# Altium schematic sheet 0214_PD CONTROLLER.SchDoc
size A3
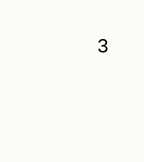
[diagram p0: 0214_PD CONTROLLER.SchDoc, top right]
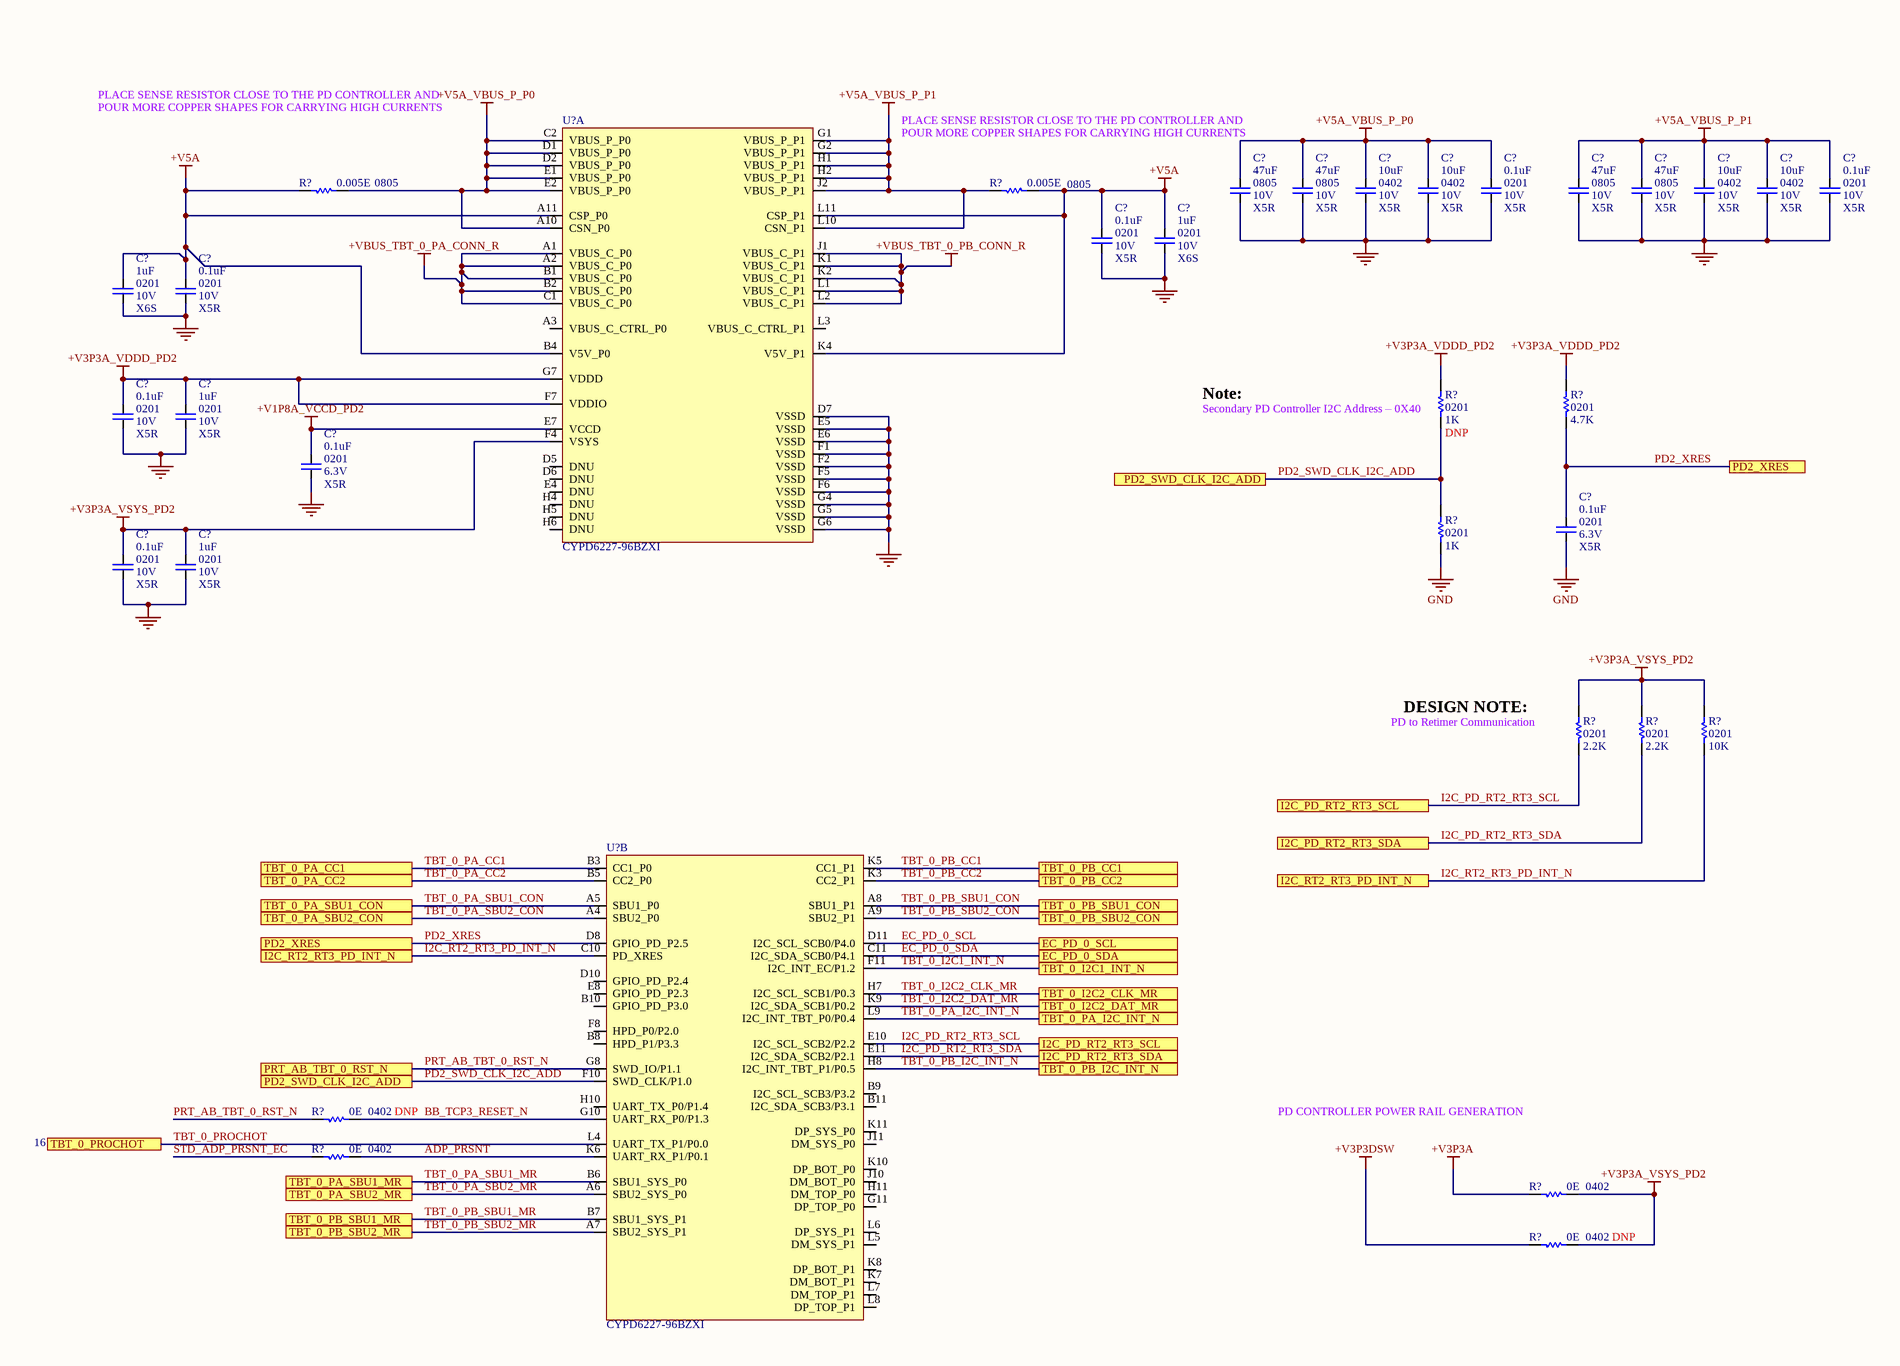
[diagram p1: 0214_PD CONTROLLER.SchDoc, bottom left]

## Parts
(Parts that share a designator on the sheet are numbered #1, #2 ... from top to bottom, then left to right.)
C?#1  value 47uF  Case/Package: 0805  Voltage: 10V  Dielectric: X5R  [CAPC0805]
C?#2  value 47uF  Case/Package: 0805  Voltage: 10V  Dielectric: X5R  [CAPC0805]
C?#3  value 10uF  Case/Package: 0402  Voltage: 10V  Dielectric: X5R  [CAPC0805]
C?#4  value 10uF  Case/Package: 0402  Voltage: 10V  Dielectric: X5R  [CAPC0805]
C?#5  value 0.1uF  Case/Package: 0201  Voltage: 10V  Dielectric: X5R  [CAPC0201]
C?#6  value 47uF  Case/Package: 0805  Voltage: 10V  Dielectric: X5R  [CAPC0805]
C?#7  value 47uF  Case/Package: 0805  Voltage: 10V  Dielectric: X5R  [CAPC0805]
C?#8  value 10uF  Case/Package: 0402  Voltage: 10V  Dielectric: X5R  [CAPC0805]
C?#9  value 10uF  Case/Package: 0402  Voltage: 10V  Dielectric: X5R  [CAPC0805]
C?#10  value 0.1uF  Case/Package: 0201  Voltage: 10V  Dielectric: X5R  [CAPC0201]
C?#11  value 0.1uF  Case/Package: 0201  Voltage: 10V  Dielectric: X5R  [CAPC0201]
C?#12  value 1uF  Case/Package: 0201  Voltage: 10V  Dielectric: X6S  [CAPC0201]
C?#13  value 1uF  Case/Package: 0201  Voltage: 10V  Dielectric: X6S  [CAPC0201]
C?#14  value 0.1uF  Case/Package: 0201  Voltage: 10V  Dielectric: X5R  [CAPC0201]
C?#15  value 0.1uF  Case/Package: 0201  Voltage: 10V  Dielectric: X5R  [CAPC0201]
C?#16  value 1uF  Case/Package: 0201  Voltage: 10V  Dielectric: X5R  [CAPC0201]
C?#17  value 0.1uF  Case/Package: 0201  Voltage: 6.3V  Dielectric: X5R  [CAPC0201]
C?#18  value 0.1uF  Case/Package: 0201  Voltage: 6.3V  Dielectric: X5R  [CAPC0201]
C?#19  value 0.1uF  Case/Package: 0201  Voltage: 10V  Dielectric: X5R  [CAPC0201]
C?#20  value 1uF  Case/Package: 0201  Voltage: 10V  Dielectric: X5R  [CAPC0201]
R?#1  value 0.005E  Case/Package: 0805  [RESC0805]  (hidden comment: Res)
R?#2  value 0.005E  Case/Package: 0805  [RESC0805]  (hidden comment: Res)
R?#3  value 1K  Case/Package: 0201  [RESC0402]  (hidden comment: Res)
R?#4  value 4.7K  Case/Package: 0201  [RESC0402]  (hidden comment: Res)
R?#5  value 1K  Case/Package: 0201  [RESC0402]  (hidden comment: Res)
R?#6  value 2.2K  Case/Package: 0201  [RESC0402]  (hidden comment: Res)
R?#7  value 2.2K  Case/Package: 0201  [RESC0402]  (hidden comment: Res)
R?#8  value 10K  Case/Package: 0201  [RESC0402]  (hidden comment: Res)
R?#9  value 0E  Case/Package: 0402  [RESC0402]  (hidden comment: Res)
R?#10  value 0E  Case/Package: 0402  [RESC0402]  (hidden comment: Res)
R?#11  value 0E  Case/Package: 0402  [RESC0402]  (hidden comment: Res)
R?#12  value 0E  Case/Package: 0402  [RESC0402]  (hidden comment: Res)
U?#1  CYPD6227-96BZXI  (part A of 2)
U?#2  CYPD6227-96BZXI  (part B of 2)

## Ports
EC_PD_0_SCL, EC_PD_0_SDA, I2C_PD_RT2_RT3_SCL, I2C_PD_RT2_RT3_SDA, I2C_RT2_RT3_PD_INT_N, PD2_SWD_CLK_I2C_ADD, PD2_XRES, PRT_AB_TBT_0_RST_N, TBT_0_I2C1_INT_N, TBT_0_I2C2_CLK_MR, TBT_0_I2C2_DAT_MR, TBT_0_PA_CC1, TBT_0_PA_CC2, TBT_0_PA_I2C_INT_N, TBT_0_PA_SBU1_CON, TBT_0_PA_SBU1_MR, TBT_0_PA_SBU2_CON, TBT_0_PA_SBU2_MR, TBT_0_PB_CC1, TBT_0_PB_CC2, TBT_0_PB_I2C_INT_N, TBT_0_PB_SBU1_CON, TBT_0_PB_SBU1_MR, TBT_0_PB_SBU2_CON, TBT_0_PB_SBU2_MR, TBT_0_PROCHOT

## Nets
+V1P8A_VCCD_PD2: C?#17.2 U?#1.E7(VCCD)
+V3P3A: R?#11.1
+V3P3A_VDDD_PD2: C?#15.2 C?#16.2 R?#3.2 R?#4.2 U?#1.F7(VDDIO) U?#1.G7(VDDD)
+V3P3A_VSYS_PD2: C?#19.2 C?#20.2 R?#6.2 R?#7.2 R?#8.2 R?#11.2 R?#12.2 U?#1.F4(VSYS)
+V3P3DSW: R?#12.1
+V5A: C?#11.2 C?#12.2 C?#13.2 C?#14.2 R?#1.1 R?#2.2 U?#1.A11(CSP_P0) U?#1.B4(V5V_P0) U?#1.K4(V5V_P1) U?#1.L11(CSP_P1)
+V5A_VBUS_P_P0: C?#1.2 C?#2.2 C?#3.2 C?#4.2 C?#5.2 R?#1.2 U?#1.A10(CSN_P0) U?#1.C2(VBUS_P_P0) U?#1.D1(VBUS_P_P0) U?#1.D2(VBUS_P_P0) U?#1.E1(VBUS_P_P0) U?#1.E2(VBUS_P_P0)
+V5A_VBUS_P_P1: C?#6.2 C?#7.2 C?#8.2 C?#9.2 C?#10.2 R?#2.1 U?#1.G1(VBUS_P_P1) U?#1.G2(VBUS_P_P1) U?#1.H1(VBUS_P_P1) U?#1.H2(VBUS_P_P1) U?#1.J2(VBUS_P_P1) U?#1.L10(CSN_P1)
+VBUS_TBT_0_PA_CONN_R: U?#1.A1(VBUS_C_P0) U?#1.A2(VBUS_C_P0) U?#1.B1(VBUS_C_P0) U?#1.B2(VBUS_C_P0) U?#1.C1(VBUS_C_P0)
+VBUS_TBT_0_PB_CONN_R: U?#1.J1(VBUS_C_P1) U?#1.K1(VBUS_C_P1) U?#1.K2(VBUS_C_P1) U?#1.L1(VBUS_C_P1) U?#1.L2(VBUS_C_P1)
GND: C?#1.1 C?#2.1 C?#3.1 C?#4.1 C?#5.1 C?#6.1 C?#7.1 C?#8.1 C?#9.1 C?#10.1 C?#11.1 C?#12.1 C?#13.1 C?#14.1 C?#15.1 C?#16.1 C?#17.1 C?#18.1 C?#19.1 C?#20.1 R?#5.1 U?#1.D7(VSSD) U?#1.E5(VSSD) U?#1.E6(VSSD) U?#1.F1(VSSD) U?#1.F2(VSSD) U?#1.F5(VSSD) U?#1.F6(VSSD) U?#1.G4(VSSD) U?#1.G5(VSSD) U?#1.G6(VSSD)
ADP_PRSNT: R?#10.2 U?#2.K6(UART_RX_P1/P0.1)
BB_TCP3_RESET_N: R?#9.2 U?#2.G10(UART_RX_P0/P1.3)
EC_PD_0_SCL: U?#2.D11(I2C_SCL_SCB0/P4.0) ; port EC_PD_0_SCL
EC_PD_0_SDA: U?#2.C11(I2C_SDA_SCB0/P4.1) ; port EC_PD_0_SDA
I2C_PD_RT2_RT3_SCL: R?#6.1 U?#2.E10(I2C_SCL_SCB2/P2.2) ; port I2C_PD_RT2_RT3_SCL
I2C_PD_RT2_RT3_SDA: R?#7.1 U?#2.E11(I2C_SDA_SCB2/P2.1) ; port I2C_PD_RT2_RT3_SDA
I2C_RT2_RT3_PD_INT_N: R?#8.1 U?#2.C10(PD_XRES) ; port I2C_RT2_RT3_PD_INT_N
PD2_SWD_CLK_I2C_ADD: R?#3.1 R?#5.2 U?#2.F10(SWD_CLK/P1.0) ; port PD2_SWD_CLK_I2C_ADD
PD2_XRES: C?#18.2 R?#4.1 U?#2.D8(GPIO_PD_P2.5) ; port PD2_XRES
PRT_AB_TBT_0_RST_N: R?#9.1 U?#2.G8(SWD_IO/P1.1) ; port PRT_AB_TBT_0_RST_N
STD_ADP_PRSNT_EC: R?#10.1
TBT_0_I2C1_INT_N: U?#2.F11(I2C_INT_EC/P1.2) ; port TBT_0_I2C1_INT_N
TBT_0_I2C2_CLK_MR: U?#2.H7(I2C_SCL_SCB1/P0.3) ; port TBT_0_I2C2_CLK_MR
TBT_0_I2C2_DAT_MR: U?#2.K9(I2C_SDA_SCB1/P0.2) ; port TBT_0_I2C2_DAT_MR
TBT_0_PA_CC1: U?#2.B3(CC1_P0) ; port TBT_0_PA_CC1
TBT_0_PA_CC2: U?#2.B5(CC2_P0) ; port TBT_0_PA_CC2
TBT_0_PA_I2C_INT_N: U?#2.L9(I2C_INT_TBT_P0/P0.4) ; port TBT_0_PA_I2C_INT_N
TBT_0_PA_SBU1_CON: U?#2.A5(SBU1_P0) ; port TBT_0_PA_SBU1_CON
TBT_0_PA_SBU1_MR: U?#2.B6(SBU1_SYS_P0) ; port TBT_0_PA_SBU1_MR
TBT_0_PA_SBU2_CON: U?#2.A4(SBU2_P0) ; port TBT_0_PA_SBU2_CON
TBT_0_PA_SBU2_MR: U?#2.A6(SBU2_SYS_P0) ; port TBT_0_PA_SBU2_MR
TBT_0_PB_CC1: U?#2.K5(CC1_P1) ; port TBT_0_PB_CC1
TBT_0_PB_CC2: U?#2.K3(CC2_P1) ; port TBT_0_PB_CC2
TBT_0_PB_I2C_INT_N: U?#2.H8(I2C_INT_TBT_P1/P0.5) ; port TBT_0_PB_I2C_INT_N
TBT_0_PB_SBU1_CON: U?#2.A8(SBU1_P1) ; port TBT_0_PB_SBU1_CON
TBT_0_PB_SBU1_MR: U?#2.B7(SBU1_SYS_P1) ; port TBT_0_PB_SBU1_MR
TBT_0_PB_SBU2_CON: U?#2.A9(SBU2_P1) ; port TBT_0_PB_SBU2_CON
TBT_0_PB_SBU2_MR: U?#2.A7(SBU2_SYS_P1) ; port TBT_0_PB_SBU2_MR
TBT_0_PROCHOT: U?#2.L4(UART_TX_P1/P0.0) ; port TBT_0_PROCHOT

Not connected (* = marked no-connect by the designer): U?#1 A3(VBUS_C_CTRL_P0) D5(DNU) D6(DNU) E4(DNU) H4(DNU) H5(DNU) H6(DNU) L3(VBUS_C_CTRL_P1); U?#2 B8(HPD_P1/P3.3) B9(I2C_SCL_SCB3/P3.2) B10(GPIO_PD_P3.0) B11(I2C_SDA_SCB3/P3.1) D10(GPIO_PD_P2.4) E8(GPIO_PD_P2.3) F8(HPD_P0/P2.0) G11(DP_TOP_P0) H10(UART_TX_P0/P1.4) H11(DM_TOP_P0) J10(DM_BOT_P0) J11(DM_SYS_P0) K7(DM_BOT_P1) K8(DP_BOT_P1) K10(DP_BOT_P0) K11(DP_SYS_P0) L5(DM_SYS_P1) L6(DP_SYS_P1) L7(DM_TOP_P1) L8(DP_TOP_P1)

## Notes on the sheet
- 3
- PLACE SENSE RESISTOR CLOSE TO THE PD CONTROLLER AND
- POUR MORE COPPER SHAPES FOR CARRYING HIGH CURRENTS
- Note:
- (near R?#3) Secondary PD Controller I2C Address – 0X40
- (near R?#6) PD to Retimer Communication
- DESIGN NOTE:
- PD CONTROLLER POWER RAIL GENERATION

## Library data of the parts
C?#1 C?#2 C?#6 C?#7 = Cap: CAP CER 47uF 10V X5R 0805
C?#3 C?#4 C?#8 C?#9 = Cap: CAP CER 10uF 10V X5R 0805
C?#5 C?#10 C?#11 C?#14 C?#15 C?#19 = Cap: CAP CER 0.1uF 10V X5R 0201
C?#12 C?#13 = Cap: CAP CER 1uF 10V X6S 0201
C?#16 C?#20 = Cap: CAP CER 1uF 10V X5R 0201
C?#17 C?#18 = Cap: CAP CER 0.1uF 6.3V X5R 0201
R?#1 R?#2 = Res: Thick Film Resistor -  0.005ohm, 1%,0805
R?#3 R?#5 = Res: Thick Film Resistor -  1Kohm, 1%,0201
  R?#3: DNP: DNP
R?#4 = Res: Thick Film Resistor -  4.7Kohm, 1%,0201
R?#6 R?#7 = Res: Thick Film Resistor -  2.2Kohm, 1%,0201
R?#8 = Res: Thick Film Resistor -  10Kohm, 1%,0201
R?#9-R?#12 = Res: Thick Film Resistor -  0ohm, 1%,0402
  R?#9 R?#12: DNP: DNP